# Altium project Main.PrjPcb
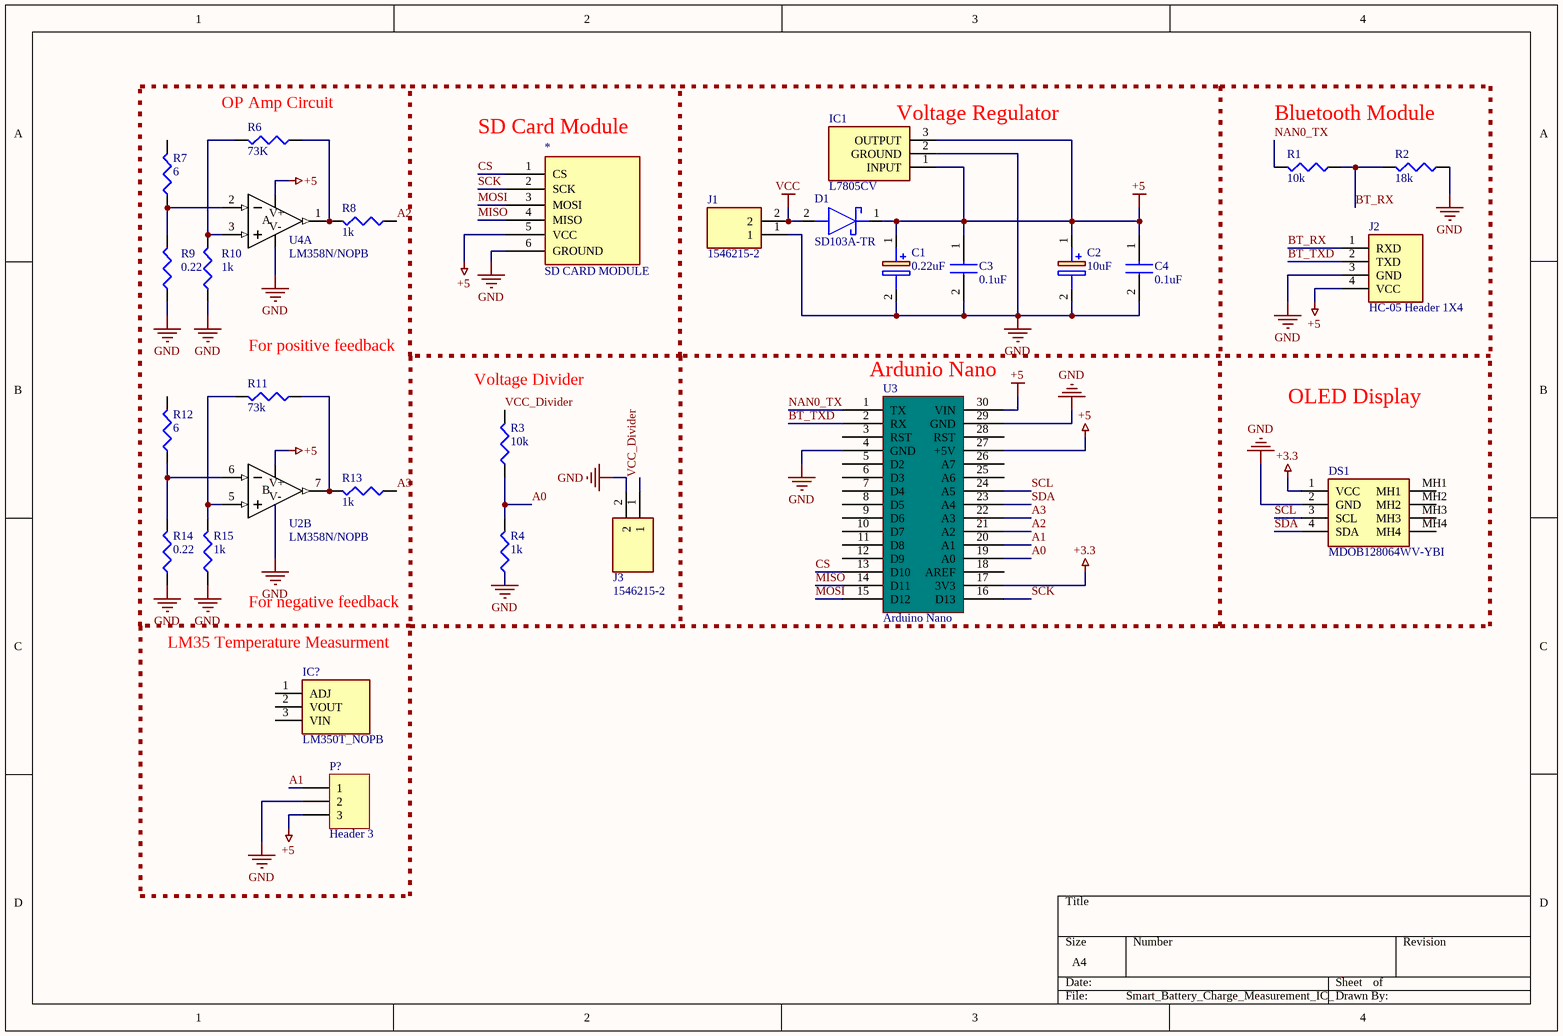
[diagram p0: Smart_Battery_Charge_Measurement_IC_Schematic.SchDoc]
1 sheet, 30 parts. Net scope: global (net labels, ports and power ports of the same name join across sheets).
Board file: Smart_Battery_Charge_Measurement_IC_PCB.PcbDoc

## Sheet Smart_Battery_Charge_Measurement_IC_Schematic.SchDoc
size A4; SheetNumber: 1; SheetTotal: 1

### Parts
*  SD CARD MODULE  [SD CARD MODULE]
C1  0.22uF  [CAPPRD200W52D500H1250]
C2  10uF  [CAPPRD200W55D500H1250]
C3  0.1uF  [RDE5C1H100J0P1H03B]
C4  0.1uF  [RDE5C1H100J0P1H03B]
D1  SD103A-TR  [DIOAD950W60L350D150]
DS1  MDOB128064WV-YBI  [MDOB128064WVYBI]
IC1  L7805CV  [TO255P460X1020X2008-3P]
IC?  LM350T_NOPB  [TO254P470X1028X1955-3P]
J1  1546215-2  [15462152]
J2  HC-05 Header 1X4  [HC-05 Header 1X4]
J3  1546215-2  [15462152]
P?  Header 3  [HDR1X3]
R1  value 10k  [J1-0603]  (hidden comment: Res3)
R2  value 18k  [J1-0603]  (hidden comment: Res3)
R3  value 10k  [J1-0603]  (hidden comment: Res3)
R4  value 1k  [J1-0603]  (hidden comment: Res3)
R6  value 73K  [J1-0603]  (hidden comment: Res3)
R7  value 6  [J1-0603]  (hidden comment: Res3)
R8  value 1k  [J1-0603]  (hidden comment: Res3)
R9  value 0.22  [J1-0603]  (hidden comment: Res3)
R10  value 1k  [J1-0603]  (hidden comment: Res3)
R11  value 73k  [J1-0603]  (hidden comment: Res3)
R12  value 6  [J1-0603]  (hidden comment: Res3)
R13  value 1k  [J1-0603]  (hidden comment: Res3)
R14  value 0.22  [J1-0603]  (hidden comment: Res3)
R15  value 1k  [J1-0603]  (hidden comment: Res3)
U2  LM358N/NOPB  [N08E]  (part B of 2)
U3  Arduino Nano  [Ardunio Nano R3]
U4  LM358N/NOPB  [N08E]  (part A of 2)

### Blocks framed on the sheet
Voltage Regulator: C1-C4 D1 IC1 J1

### Nets
+3.3: DS1.1(VCC) U3.17(3V3)
+5: *.5(VCC) C1.1(+) C2.1(+) C3.1 C4.1 D1.1(K) IC1.1(INPUT) IC1.3(OUTPUT) J2.4(VCC) P?.3 U3.27(+5V) U3.30(VIN)
GND: *.6(GROUND) C1.2(-) C2.2(-) C3.2 C4.2 DS1.2(GND) IC1.2(GROUND) J1.1 J2.3(GND) J3.2 P?.2 R2.1 R4.1 R9.1 R10.1 R14.1 R15.1 U3.4(GND) U3.29(GND)
VCC: D1.2(A) J1.2
A0: R3.1 R4.2 U3.19(A0)
A1: P?.1 U3.20(A1)
A2: R8.1 U3.21(A2)
A3: R13.1 U3.22(A3)
BT_RX: J2.1(RXD) R1.1 R2.2
BT_TXD: J2.2(TXD) U3.2(RX)
CS: *.1(CS) U3.13(D10)
MISO: *.4(MISO) U3.14(D11)
MOSI: *.3(MOSI) U3.15(D12)
NAN0_TX: R1.2 U3.1(TX)
SCK: *.2(SCK) U3.16(D13)
SCL: DS1.3(SCL) U3.24(A5)
SDA: DS1.4(SDA) U3.23(A4)
VCC_Divider: J3.1 R3.2
NetR6_1: R6.1 R8.2 U4.1(OUT)
NetR6_2: R6.2 R10.2 U4.3(IN+)
NetR7_1: R7.1 R9.2 U4.2(IN-)
NetR11_1: R11.1 R13.2 U2.7(OUT)
NetR11_2: R11.2 R15.2 U2.5(IN+)
NetR12_1: R12.1 R14.2 U2.6(IN-)

Not connected (* = marked no-connect by the designer): DS1 MH1 MH2 MH3 MH4; IC? 1(ADJ) 2(VOUT) 3(VIN); R7 2; R12 2; U3 3(RST) 5(D2) 6(D3) 7(D4) 8(D5) 9(D6) 10(D7) 11(D8) 12(D9) 18(AREF) 25(A6) 26(A7) 28(RST)

### Notes on the sheet
- (near R6) OP Amp Circuit
- (near *) SD Card Module
- Bluetooth Module
- For positive feedback
- (near R3) Voltage Divider
- (near U3) Ardunio Nano
- OLED Display
- LM35 Temperature Measurment
- (near R15) For negative feedback
- (in symbol LM358N/NOPB, part A) V+; A; V-
- (in symbol LM358N/NOPB, part B) V+; B; V-

### Library data of the parts
C1 = 860010772002: Capacitor Polarised; Manufacturer_Name: Wurth Elektronik; Datasheet Link: https://componentsearchengine.com/Datasheets/1/860010772002.pdf; Height: 12.5mm; Manufacturer_Part_Number: 860010772002; Mouser Part Number: 710-860010772002; Mouser Price/Stock: https://www.mouser.co.uk/ProductDetail/Wurth-Elektronik/860010772002?qs=0KOYDY2FL2%2FXueoM4QQtRg%3D%3D
C2 = EEU-FR1H100: Capacitor Polarised; Manufacturer_Name: Panasonic; Datasheet Link: http://industrial.panasonic.com/cdbs/www-data/pdf/RDF0000/ABA0000C1259.pdf; Height: 12.5mm; Manufacturer_Part_Number: EEU-FR1H100; Mouser Part Number: 667-EEU-FR1H100; Mouser Price/Stock: https://www.mouser.co.uk/ProductDetail/Panasonic/EEU-FR1H100?qs=tfZGHB2PWd1NAbdNSgjToQ%3D%3D
C3 C4 = RDER71E104K0P1H03B: Capacitor; Manufacturer_Name: Murata Electronics; Datasheet Link: https://psearch.en.murata.com/capacitor/product/RDER71E104K0P1H03B.html; Height: 6mm; Manufacturer_Part_Number: RDER71E104K0P1H03B; Mouser Part Number: 81-RDER71E104K0P1H3B; Mouser Price/Stock: https://www.mouser.co.uk/ProductDetail/Murata-Electronics/RDER71E104K0P1H03B?qs=hNud%2FORuBR1RYUkyJwpo2Q%3D%3D; Arrow Part Number: RDER71E104K0P1H03B; Arrow Price/Stock: https://www.arrow.com/en/products/rder71e104k0p1h03b/murata-manufacturing?region=nac
D1 = SD103A-TR: Schottky Diode; Manufacturer_Name: Vishay; Datasheet Link: https://componentsearchengine.com/Datasheets/5/SD103A-TR.pdf; Manufacturer_Part_Number: SD103A-TR; Mouser Part Number: 625-SD103A; Mouser Price/Stock: https://www.mouser.co.uk/ProductDetail/Vishay-Semiconductors/SD103A-TR?qs=RwahMLkpD2urFD%2FzZdGOBw%3D%3D; Arrow Part Number: SD103A-TR; Arrow Price/Stock: https://www.arrow.com/en/products/sd103a-tr/vishay?region=nac
DS1 = MDOB128064WV-YBI: Display; Manufacturer_Name: MIDAS; Datasheet Link: https://www.midasdisplays.com/getattachment/fada0345-3815-4682-b4f7-385dd3f5cb09/specification; Height: 4.52mm; Manufacturer_Part_Number: MDOB128064WV-YBI
IC1 = L7805CV: Integrated Circuit; Manufacturer_Name: STMicroelectronics; Datasheet Link: http://www.st.com/web/en/resource/technical/document/datasheet/CD00000444.pdf; Height: 4.6mm; Manufacturer_Part_Number: L7805CV; Mouser Part Number: 511-L7805CV; Mouser Price/Stock: https://www.mouser.co.uk/ProductDetail/STMicroelectronics/L7805CV?qs=9NrABl3fj%2FqplZAHiYUxWg%3D%3D; Arrow Part Number: L7805CV; Arrow Price/Stock: https://www.arrow.com/en/products/l7805cv/stmicroelectronics?region=europe
IC? = LM350T_NOPB: Integrated Circuit; Manufacturer_Name: Texas Instruments; Manufacturer_Part_Number: LM350T/NOPB; Datasheet Link: http://www.ti.com/lit/gpn/lm350-n; Height: 4.7mm; Mouser Part Number: 926-LM350T/NOPB; Mouser Price/Stock: https://www.mouser.co.uk/ProductDetail/Texas-Instruments/LM350T-NOPB?qs=QbsRYf82W3HTcoWmKYOrGA%3D%3D; Arrow Part Number: LM350T/NOPB; Arrow Price/Stock: https://www.arrow.com/en/products/lm350tnopb/texas-instruments?region=nac
J1 J3 = 1546215-2: Connector; Manufacturer_Name: TE Connectivity; Datasheet Link: https://www.te.com/commerce/DocumentDelivery/DDEController?Action=srchrtrv&DocNm=1546215&DocType=Customer+Drawing&DocLang=English; Height: 10.3mm; Manufacturer_Part_Number: 1546215-2; Mouser Part Number: 571-1546215-2; Mouser Price/Stock: https://www.mouser.co.uk/ProductDetail/TE-Connectivity/1546215-2?qs=Lxq28tKK6BPmJFoAOY7Ljw%3D%3D; Arrow Part Number: 1546215-2; Arrow Price/Stock: https://www.arrow.com/en/products/1546215-2/te-connectivity?region=nac
J2 = HC-05 Header 1X4: Bluetooth Module Header; Manufacturer_Name: Molex; Manufacturer_Part_Number: 0022032041; Datasheet Link: http://www.molex.com/pdm_docs/sd/022032041_sd.pdf; Height: 11.55mm; Mouser Part Number: N/A; Mouser Price/Stock: https://www.mouser.co.uk/ProductDetail/Molex/0022032041?qs=PBcRNPEHKsrt5pJfEqGMHQ%3D%3D; Arrow Part Number: 0022032041; Arrow Price/Stock: https://www.arrow.com/en/products/0022032041/molex?region=europe
P? = Header 3: Header, 3-Pin; LatestRevisionDate: 17-Jul-2002; LatestRevisionNote: Re-released for DXP Platform.; Publisher: Altium Limited
R1-R4 R6-R15 = Res3: Resistor; Published: 8-Jun-2000; LatestRevisionDate: 29-May-2009; LatestRevisionNote: IPC-7351 Footprint Added.; PackageReference: J1-0603; Publisher: Altium Limited; PackageDescription: Chip Resistor
U2 U4 = LM358N/NOPB: OP AMP; Mfr_Name: Texas Instruments; PartNumber: LM358AN; Manufacturer: NationalSemiconductor; Characteristics: LM358ANLowPowerDualOpAmp; CompType: OpAmpIC; TaMin_C: 00; TaMax_C: 700; ComponentLink1DescBC: LM358Datasheet; ComponentLink2DescA4: LM358WebPage; ComponentLink3DescAC: N08EPackageWebPage; SymbolVersion: 2008-07-09; PackageDescription: 8LeadPlasticDIP; PackageReference: N08E_L; RoHS: O; ComponentLink1URL: http//wwwnationalcom/ds/LM/LM358pdf; ComponentLink2URL: http//wwwnationalcom/pf/LM/LM358html; ComponentLink3URL: http//wwwnationalcom/packaging/folders/n08ehtml; Version: B1608; LatestRevisionDate: 2009-03-16; LatestRevisionNote: MassUpdate; Publisher: NationalSemiconductor; Published: 2009-03-16
U3 = Ardunio Nano R3